# Altium schematic sheet top.SchDoc
size A3
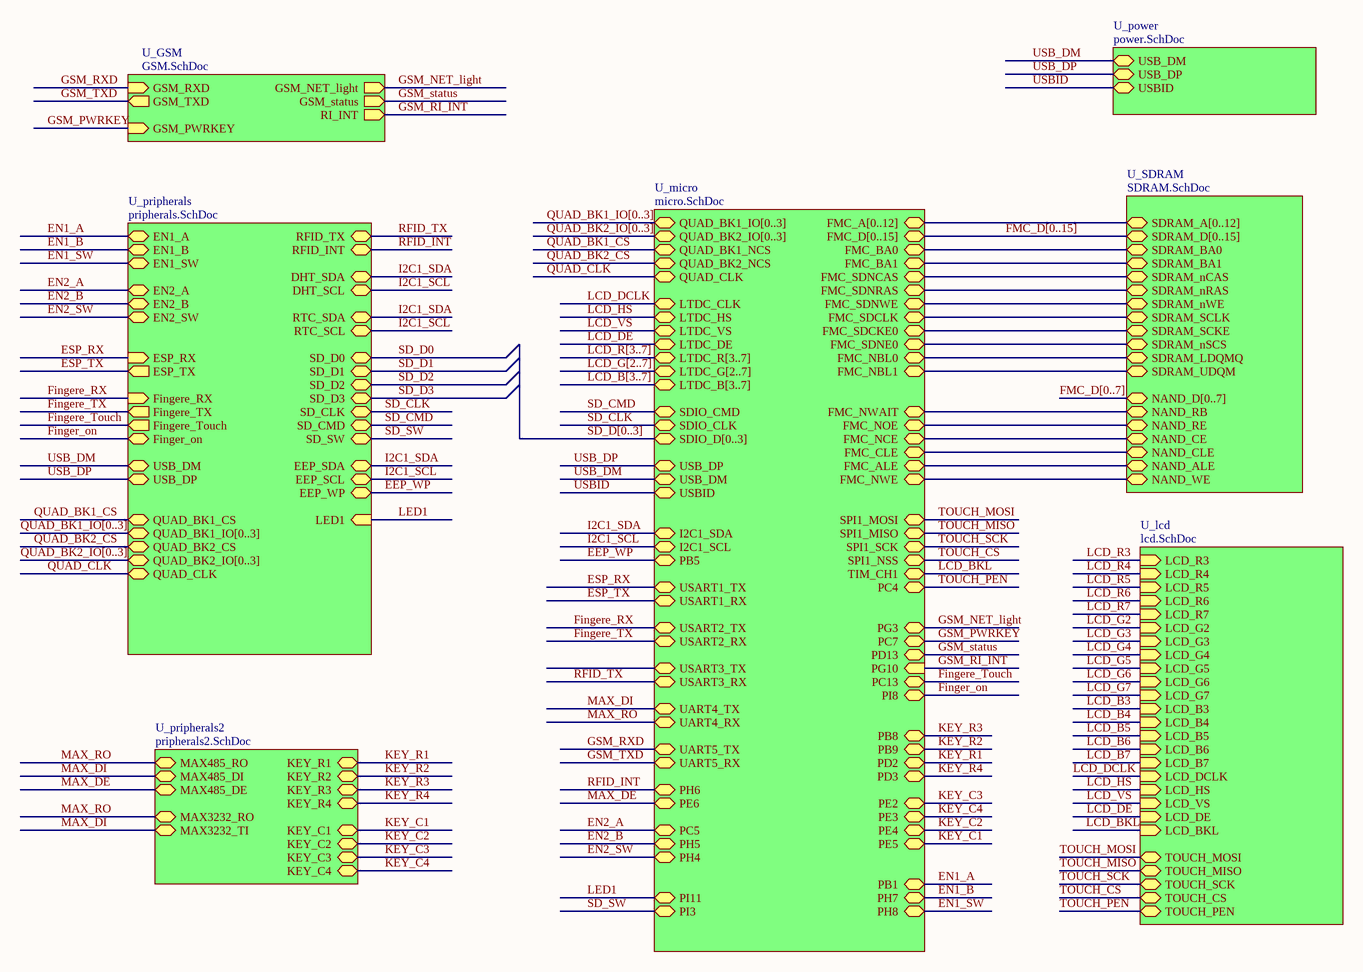
[diagram p0: top.SchDoc]

## Sub-sheets
U_GSM = GSM.SchDoc: GSM_PWRKEY (in), GSM_RXD (in), GSM_TXD (out), GSM_NET_light (out), GSM_status (out), RI_INT (out)
U_lcd = lcd.SchDoc: TOUCH_SCK (bidir), TOUCH_CS (bidir), TOUCH_MOSI (bidir), TOUCH_MISO (bidir), TOUCH_PEN (bidir), LCD_B5 (in), LCD_B4 (in), LCD_R7 (in), LCD_B6 (in), LCD_G7 (in), LCD_G6 (in), LCD_G3 (in), LCD_R3 (in), LCD_R5 (in), LCD_R4 (in), LCD_B7 (in), LCD_R6 (in), LCD_G2 (in), LCD_B3 (in), LCD_G5 (in), LCD_G4 (in), LCD_DCLK (in), LCD_DE (in), LCD_HS (in), LCD_VS (in), LCD_BKL (in)
U_micro = micro.SchDoc: FMC_A[0..12] (bidir), FMC_D[0..15] (bidir), QUAD_BK1_IO[0..3] (bidir), QUAD_BK2_IO[0..3] (bidir), LTDC_B[3..7] (bidir), LTDC_R[3..7] (bidir), LTDC_G[2..7] (bidir), SDIO_D[0..3] (bidir), FMC_NCE (bidir), FMC_SDCLK (bidir), FMC_ALE (bidir), FMC_SDNRAS (bidir), FMC_CLE (bidir), FMC_SDNE0 (bidir), FMC_NOE (bidir), FMC_BA1 (bidir), FMC_SDCKE0 (bidir), LTDC_VS (bidir), FMC_NWAIT (bidir), FMC_SDNCAS (bidir), QUAD_BK1_NCS (bidir), LTDC_DE (bidir), LTDC_HS (bidir), LTDC_CLK (bidir), FMC_SDNWE (bidir), QUAD_BK2_NCS (bidir), QUAD_CLK (bidir), FMC_NWE (bidir), SDIO_CLK (bidir), FMC_BA0 (bidir), SDIO_CMD (bidir), FMC_NBL0 (bidir), FMC_NBL1 (bidir), USB_DM (bidir), USB_DP (bidir), SPI1_MOSI (bidir), SPI1_MISO (bidir), TIM_CH1 (bidir), SPI1_SCK (bidir), SPI1_NSS (bidir), PC4 (bidir), I2C1_SDA (bidir), I2C1_SCL (bidir), PB5 (bidir), USART3_TX (bidir), UART5_RX (bidir), UART4_TX (bidir), USART2_TX (bidir), USART1_RX (bidir), USART2_RX (bidir), UART4_RX (bidir), UART5_TX (bidir), USART1_TX (bidir), USART3_RX (bidir), PH6 (bidir), PG3 (bidir), PC7 (bidir), PD13 (bidir), PC13 (bidir), PI8 (bidir), PB8 (bidir), PB9 (bidir), PE3 (bidir), PD2 (bidir), PD3 (bidir), PE2 (bidir), PE4 (bidir), PE5 (bidir), PB1 (bidir), PH8 (bidir), PH7 (bidir), PH4 (bidir), PC5 (bidir), PH5 (bidir), PE6 (bidir), PI3 (bidir), PI11 (bidir), PG10 (in), USBID (bidir)
U_power = power.SchDoc: USB_DM (bidir), USB_DP (bidir), USBID (bidir)
U_pripherals = pripherals.SchDoc: RFID_TX (bidir), RFID_INT (bidir), DHT_SDA (bidir), DHT_SCL (bidir), RTC_SDA (bidir), RTC_SCL (bidir), SD_D0 (bidir), SD_D1 (bidir), SD_D2 (bidir), SD_D3 (bidir), SD_CMD (bidir), SD_CLK (bidir), SD_SW (bidir), EN1_A (bidir), EN1_B (bidir), EN1_SW (bidir), EN2_A (bidir), EN2_B (bidir), EN2_SW (bidir), ESP_TX (out), ESP_RX (in), Fingere_RX (in), Fingere_TX (out), Fingere_Touch (out), EEP_SCL (bidir), EEP_WP (bidir), EEP_SDA (bidir), Finger_on (bidir), LED1 (in), USB_DM (bidir), USB_DP (bidir), QUAD_BK1_CS (bidir), QUAD_BK2_IO[0..3] (bidir), QUAD_BK1_IO[0..3] (bidir), QUAD_BK2_CS (bidir), QUAD_CLK (bidir)
U_pripherals2 = pripherals2.SchDoc: MAX485_RO (bidir), MAX485_DE (bidir), MAX485_DI (bidir), KEY_R1 (bidir), KEY_R2 (bidir), KEY_R3 (bidir), KEY_R4 (bidir), KEY_C1 (bidir), KEY_C2 (bidir), KEY_C3 (bidir), KEY_C4 (bidir), MAX3232_RO (bidir), MAX3232_TI (bidir)
U_SDRAM = SDRAM.SchDoc: SDRAM_D[0..15] (bidir), SDRAM_A[0..12] (bidir), NAND_ALE (bidir), SDRAM_BA0 (bidir), SDRAM_nSCS (bidir), SDRAM_nRAS (bidir), NAND_RE (bidir), SDRAM_nWE (bidir), SDRAM_SCKE (bidir), SDRAM_nCAS (bidir), NAND_CE (bidir), SDRAM_LDQMQ (bidir), NAND_D[0..7] (bidir), NAND_CLE (bidir), NAND_WE (bidir), SDRAM_UDQM (bidir), NAND_RB (bidir), SDRAM_SCLK (bidir), SDRAM_BA1 (bidir)

## Nets
EEP_WP: sheet U_micro/PB5, sheet U_pripherals/EEP_WP
EN1_A: sheet U_micro/PB1, sheet U_pripherals/EN1_A
EN1_B: sheet U_micro/PH7, sheet U_pripherals/EN1_B
EN1_SW: sheet U_micro/PH8, sheet U_pripherals/EN1_SW
EN2_A: sheet U_micro/PC5, sheet U_pripherals/EN2_A
EN2_B: sheet U_micro/PH5, sheet U_pripherals/EN2_B
EN2_SW: sheet U_micro/PH4, sheet U_pripherals/EN2_SW
ESP_RX: sheet U_micro/USART1_TX, sheet U_pripherals/ESP_RX
ESP_TX: sheet U_micro/USART1_RX, sheet U_pripherals/ESP_TX
Finger_on: sheet U_micro/PI8, sheet U_pripherals/Finger_on
Fingere_RX: sheet U_micro/USART2_TX, sheet U_pripherals/Fingere_RX
Fingere_Touch: sheet U_micro/PC13, sheet U_pripherals/Fingere_Touch
Fingere_TX: sheet U_micro/USART2_RX, sheet U_pripherals/Fingere_TX
GSM_NET_light: sheet U_micro/PG3, sheet U_GSM/GSM_NET_light
GSM_PWRKEY: sheet U_micro/PC7, sheet U_GSM/GSM_PWRKEY
GSM_RI_INT: sheet U_micro/PG10, sheet U_GSM/RI_INT
GSM_RXD: sheet U_micro/UART5_TX, sheet U_GSM/GSM_RXD
GSM_status: sheet U_micro/PD13, sheet U_GSM/GSM_status
GSM_TXD: sheet U_micro/UART5_RX, sheet U_GSM/GSM_TXD
I2C1_SCL: sheet U_micro/I2C1_SCL, sheet U_pripherals/DHT_SCL, sheet U_pripherals/RTC_SCL, sheet U_pripherals/EEP_SCL
I2C1_SDA: sheet U_micro/I2C1_SDA, sheet U_pripherals/DHT_SDA, sheet U_pripherals/RTC_SDA, sheet U_pripherals/EEP_SDA
KEY_C1: sheet U_micro/PE5, sheet U_pripherals2/KEY_C1
KEY_C2: sheet U_micro/PE4, sheet U_pripherals2/KEY_C2
KEY_C3: sheet U_micro/PE2, sheet U_pripherals2/KEY_C3
KEY_C4: sheet U_micro/PE3, sheet U_pripherals2/KEY_C4
KEY_R1: sheet U_micro/PD2, sheet U_pripherals2/KEY_R1
KEY_R2: sheet U_micro/PB9, sheet U_pripherals2/KEY_R2
KEY_R3: sheet U_micro/PB8, sheet U_pripherals2/KEY_R3
KEY_R4: sheet U_micro/PD3, sheet U_pripherals2/KEY_R4
LCD_B3: sheet U_lcd/LCD_B3
LCD_B4: sheet U_lcd/LCD_B4
LCD_B5: sheet U_lcd/LCD_B5
LCD_B6: sheet U_lcd/LCD_B6
LCD_B7: sheet U_lcd/LCD_B7
LCD_BKL: sheet U_micro/TIM_CH1, sheet U_lcd/LCD_BKL
LCD_DCLK: sheet U_micro/LTDC_CLK, sheet U_lcd/LCD_DCLK
LCD_DE: sheet U_micro/LTDC_DE, sheet U_lcd/LCD_DE
LCD_G2: sheet U_lcd/LCD_G2
LCD_G3: sheet U_lcd/LCD_G3
LCD_G4: sheet U_lcd/LCD_G4
LCD_G5: sheet U_lcd/LCD_G5
LCD_G6: sheet U_lcd/LCD_G6
LCD_G7: sheet U_lcd/LCD_G7
LCD_HS: sheet U_micro/LTDC_HS, sheet U_lcd/LCD_HS
LCD_R3: sheet U_lcd/LCD_R3
LCD_R4: sheet U_lcd/LCD_R4
LCD_R5: sheet U_lcd/LCD_R5
LCD_R6: sheet U_lcd/LCD_R6
LCD_R7: sheet U_lcd/LCD_R7
LCD_VS: sheet U_micro/LTDC_VS, sheet U_lcd/LCD_VS
LED1: sheet U_micro/PI11, sheet U_pripherals/LED1
MAX_DE: sheet U_micro/PE6, sheet U_pripherals2/MAX485_DE
MAX_DI: sheet U_micro/UART4_TX, sheet U_pripherals2/MAX485_DI, sheet U_pripherals2/MAX3232_TI
MAX_RO: sheet U_micro/UART4_RX, sheet U_pripherals2/MAX485_RO, sheet U_pripherals2/MAX3232_RO
QUAD_BK1_CS: sheet U_micro/QUAD_BK1_NCS, sheet U_pripherals/QUAD_BK1_CS
QUAD_BK2_CS: sheet U_micro/QUAD_BK2_NCS, sheet U_pripherals/QUAD_BK2_CS
QUAD_CLK: sheet U_micro/QUAD_CLK, sheet U_pripherals/QUAD_CLK
RFID_INT: sheet U_micro/PH6, sheet U_pripherals/RFID_INT
RFID_TX: sheet U_micro/USART3_RX, sheet U_pripherals/RFID_TX
SD_CLK: sheet U_micro/SDIO_CLK, sheet U_pripherals/SD_CLK
SD_CMD: sheet U_micro/SDIO_CMD, sheet U_pripherals/SD_CMD
SD_D0: sheet U_pripherals/SD_D0
SD_D1: sheet U_pripherals/SD_D1
SD_D2: sheet U_pripherals/SD_D2
SD_D3: sheet U_pripherals/SD_D3
SD_SW: sheet U_micro/PI3, sheet U_pripherals/SD_SW
TOUCH_CS: sheet U_micro/SPI1_NSS, sheet U_lcd/TOUCH_CS
TOUCH_MISO: sheet U_micro/SPI1_MISO, sheet U_lcd/TOUCH_MISO
TOUCH_MOSI: sheet U_micro/SPI1_MOSI, sheet U_lcd/TOUCH_MOSI
TOUCH_PEN: sheet U_micro/PC4, sheet U_lcd/TOUCH_PEN
TOUCH_SCK: sheet U_micro/SPI1_SCK, sheet U_lcd/TOUCH_SCK
USB_DM: sheet U_micro/USB_DM, sheet U_power/USB_DM, sheet U_pripherals/USB_DM
USB_DP: sheet U_micro/USB_DP, sheet U_power/USB_DP, sheet U_pripherals/USB_DP
USBID: sheet U_micro/USBID, sheet U_power/USBID
(unnamed): sheet U_micro/FMC_NCE, sheet U_SDRAM/NAND_CE
(unnamed): sheet U_micro/FMC_SDCLK, sheet U_SDRAM/SDRAM_SCLK
(unnamed): sheet U_micro/FMC_ALE, sheet U_SDRAM/NAND_ALE
(unnamed): sheet U_micro/FMC_SDNRAS, sheet U_SDRAM/SDRAM_nRAS
(unnamed): sheet U_micro/FMC_CLE, sheet U_SDRAM/NAND_CLE
(unnamed): sheet U_micro/FMC_SDNE0, sheet U_SDRAM/SDRAM_nSCS
(unnamed): sheet U_micro/FMC_NOE, sheet U_SDRAM/NAND_RE
(unnamed): sheet U_micro/FMC_BA1, sheet U_SDRAM/SDRAM_BA1
(unnamed): sheet U_micro/FMC_SDCKE0, sheet U_SDRAM/SDRAM_SCKE
(unnamed): sheet U_micro/FMC_NWAIT, sheet U_SDRAM/NAND_RB
(unnamed): sheet U_micro/FMC_SDNCAS, sheet U_SDRAM/SDRAM_nCAS
(unnamed): sheet U_micro/FMC_SDNWE, sheet U_SDRAM/SDRAM_nWE
(unnamed): sheet U_micro/FMC_NWE, sheet U_SDRAM/NAND_WE
(unnamed): sheet U_micro/FMC_BA0, sheet U_SDRAM/SDRAM_BA0
(unnamed): sheet U_micro/FMC_NBL0, sheet U_SDRAM/SDRAM_LDQMQ
(unnamed): sheet U_micro/FMC_NBL1, sheet U_SDRAM/SDRAM_UDQM

## Buses and harness runs
bus FMC_D[0..7] = sheet U_SDRAM/NAND_D[0..7]
bus FMC_D[0..15] = sheet U_micro/FMC_D[0..15] = sheet U_SDRAM/SDRAM_D[0..15]
bus LCD_B[3..7] = sheet U_micro/LTDC_B[3..7]
bus LCD_G[2..7] = sheet U_micro/LTDC_G[2..7]
bus LCD_R[3..7] = sheet U_micro/LTDC_R[3..7]
bus QUAD_BK1_IO[0..3] = sheet U_micro/QUAD_BK1_IO[0..3]
bus QUAD_BK1_IO[0..3] = sheet U_pripherals/QUAD_BK1_IO[0..3]
bus QUAD_BK2_IO[0..3] = sheet U_micro/QUAD_BK2_IO[0..3]
bus QUAD_BK2_IO[0..3] = sheet U_pripherals/QUAD_BK2_IO[0..3]
bus SD_D[0..3] = sheet U_micro/SDIO_D[0..3]
bus sheet U_micro/FMC_A[0..12] = sheet U_SDRAM/SDRAM_A[0..12]